# EasyEDA schematic schematic.json
TITLE: Sheet_1; REV: 1.0; Date: 2023-08-12; Sheet: 1/1; Drawn By: floppymon; Company: Your Company
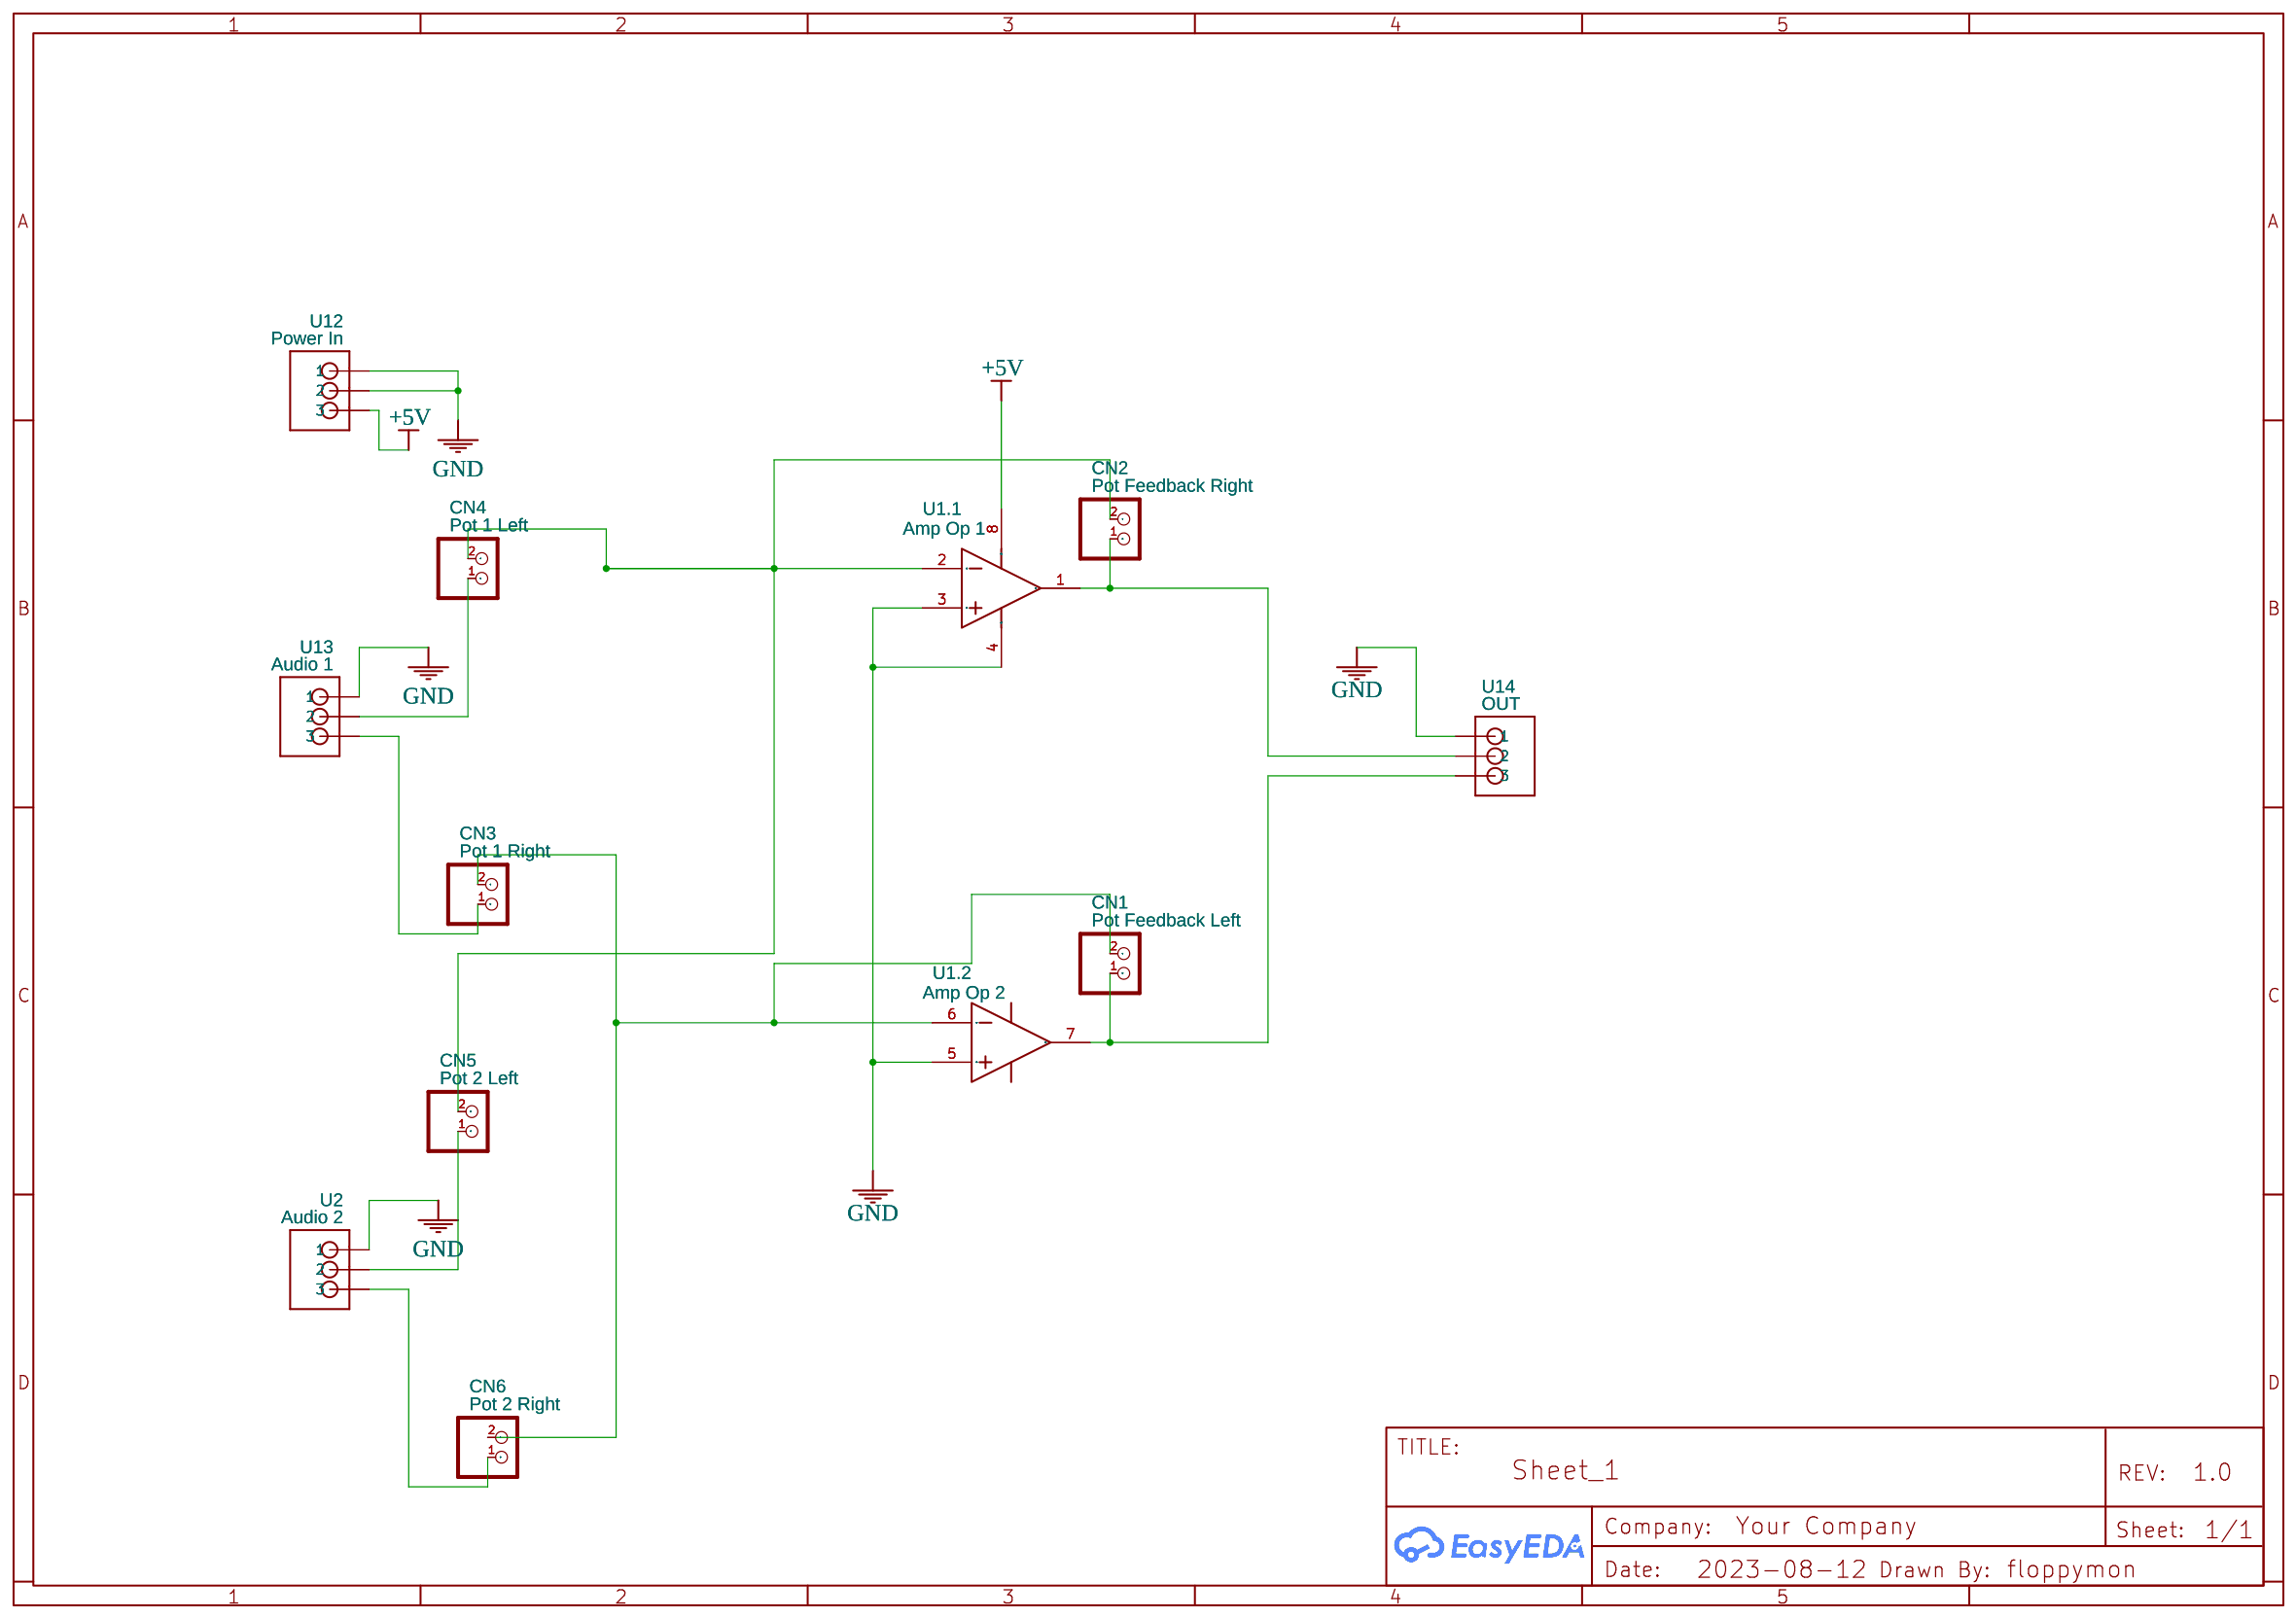
[diagram p0: schematic sheet]

## Parts
CN1  Pot Feedback Left  [JST-PH-2-THM]
CN2  Pot Feedback Right  [JST-PH-2-THM]
CN3  Pot 1 Right  [JST-PH-2-THM]
CN4  Pot 1 Left  [JST-PH-2-THM]
CN5  Pot 2 Left  [JST-PH-2-THM]
CN6  Pot 2 Right  [JST-PH-2-THM]
U1  Amp Op 1  [DIP-8_L9.4-W6.4-P2.54-LS9.1-BL]  (sections 1,2)
U2  Audio 2  [JST_B3B-PH_HEADER]
U12  Power In  [JST_B3B-PH_HEADER]
U13  Audio 1  [JST_B3B-PH_HEADER]
U14  OUT  [JST_B3B-PH_HEADER]

## Library data of the parts
CN1-CN6 = JST_2PIN-THM: JST 2-Pin Connectors of various flavors; Contributor: Adafruit
U1 = NE5532P: tags: Audio Operational Amplifier; subpart_no: 1; image: http://image.lceda.cn/szlcsc/C5326.jpg; Supplier Part: C5326; Supplier: LCSC; Manufacturer: TI(德州仪器); JLCPCB Part Class: Extended Part; link: https://lcsc.com/eda_search?q=C5326&%26type=1&ref=editor
U2 U12-U14 = JST-PH_3-PIN_HEADER

## Nets
+5V: U1.8(VCC+) U12.P3(3)
GND: U1.3(IN1+) U1.4(VCC-) U1.5(IN2+) U2.P1(1) U12.P1(1) U12.P2(2) U13.P1(1) U14.P1(1)
Net-(CN1-1): CN1.1(2) U1.7(OUT2) U14.P3(3)
Net-(CN1-2): CN1.2(1) CN3.2(1) CN6.2(1) U1.6(IN2-)
Net-(CN2-1): CN2.1(2) U1.1(OUT1) U14.P2(2)
Net-(CN2-2): CN2.2(1) CN4.2(1) CN5.2(1) U1.2(IN1-)
Net-(CN3-1): CN3.1(2) U13.P3(3)
Net-(CN4-1): CN4.1(2) U13.P2(2)
Net-(CN5-1): CN5.1(2) U2.P2(2)
Net-(CN6-1): CN6.1(2) U2.P3(3)
